# EAGLE design TeamB_PDS_Schematic_new (EAGLE 7.1.0)
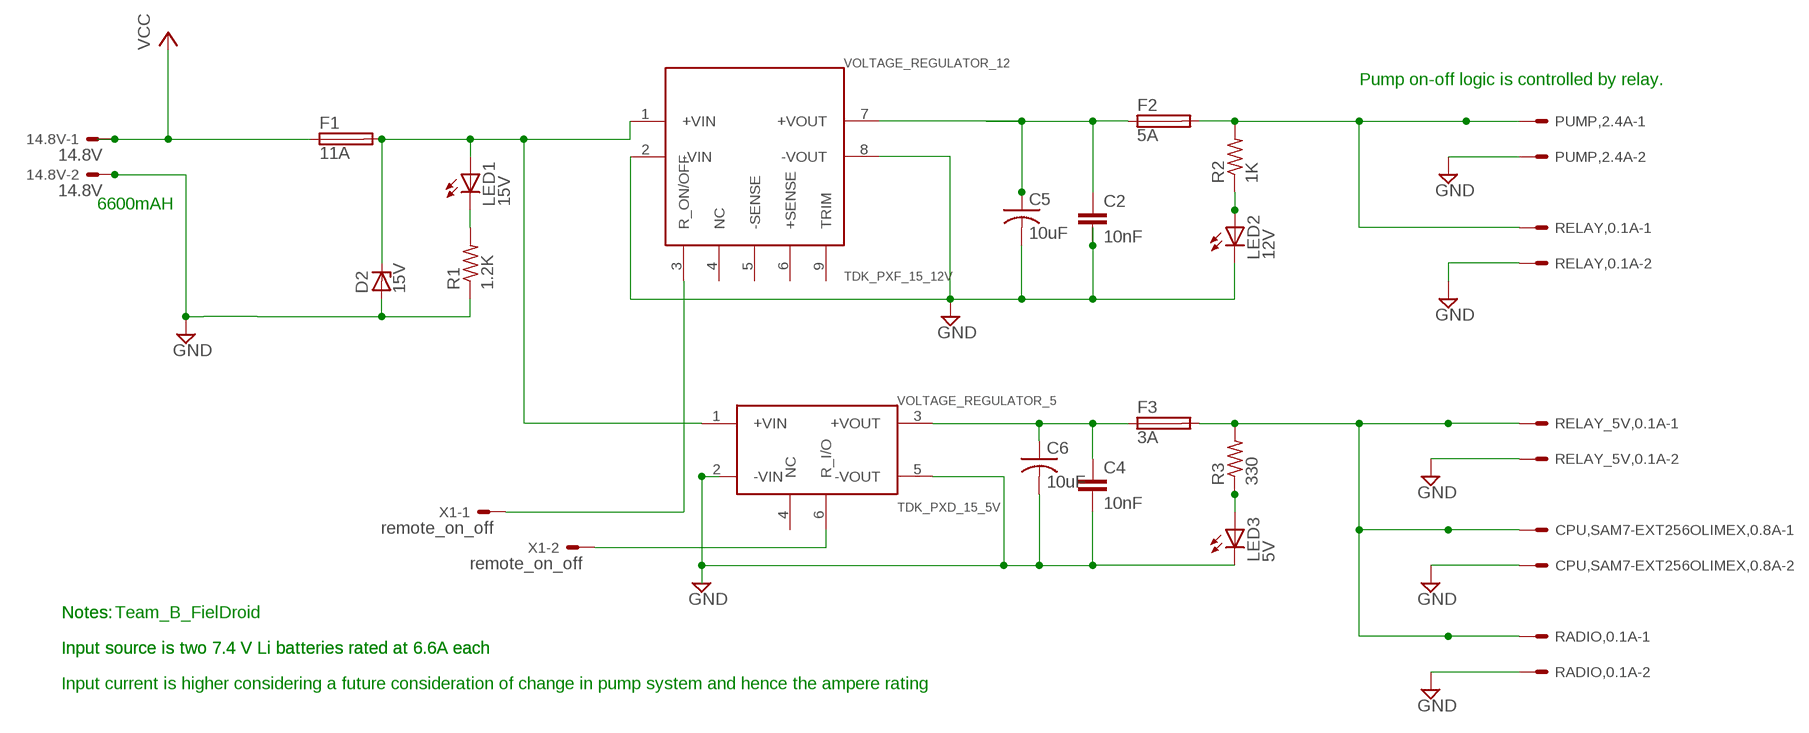
[diagram p0: schematic, sheet 1]

## Parts
14.8V  14.8V  5566-2  [5566-2]
C2  10nF  C2.5/4  [C2.5-4]
C4  10nF  C2.5/4  [C2.5-4]
C5  10uF  C-US050-045X075  [C050-045X075]
C6  10uF  C-US050-045X075  [C050-045X075]
CPU,SAM7-EXT256OLIMEX,0.8A  5566-2  [5566-2]
D2  15V  1N4728  [DO41Z10]
F1  11A  FUSEBLANK_5X20MM  [FUSE_HOLDER_5X20MM]
F2  5A  FUSEBLANK_5X20MM  [FUSE_HOLDER_5X20MM]
F3  3A  FUSEBLANK_5X20MM  [FUSE_HOLDER_5X20MM]
LED1  15V  LED5MM  [LED5MM]
LED2  12V  LED5MM  [LED5MM]
LED3  5V  LED5MM  [LED5MM]
PUMP,2.4A  5566-2  [5566-2]
R1  1.2K  R-US_0309/12  [0309/12]
R2  1K  R-US_0309/12  [0309/12]
R3  330  R-US_0309/12  [0309/12]
RADIO,0.1A  5566-2  [5566-2]
RELAY,0.1A  5566-2  [5566-2]
RELAY_5V,0.1A  5566-2  [5566-2]
VOLTAGE_REGULATOR_5  TDK_PXD_15_5V  [TDK-PXD_15-5V]
VOLTAGE_REGULATOR_12  TDK_PXF_15_12V  [TDK_PXF_15_12V]
X1  remote_on_off  5566-2  [5566-2]

## Nets
GND: 14.8V.2 C2.2 C4.2 C5.2 C6.2 CPU,SAM7-EXT256OLIMEX,0.8A.2 D2.A LED2.K(C) LED3.K(C) PUMP,2.4A.2 R1.1 RADIO,0.1A.2 RELAY,0.1A.2 RELAY_5V,0.1A.2 VOLTAGE_REGULATOR_5.2(-VIN) VOLTAGE_REGULATOR_5.5(-VOUT) VOLTAGE_REGULATOR_12.2(-VIN) VOLTAGE_REGULATOR_12.8(-VOUT)
N$1: LED1.K(C) R1.2
N$2: C4.1 C6.1 F3.1 VOLTAGE_REGULATOR_5.3(+VOUT)
N$3: D2.C F1.2 LED1.A VOLTAGE_REGULATOR_5.1(+VIN) VOLTAGE_REGULATOR_12.1(+VIN)
N$4: C2.1 C5.1 F2.1 VOLTAGE_REGULATOR_12.7(+VOUT)
N$5: LED2.A R2.1
N$6: VOLTAGE_REGULATOR_12.3(R_ON/OFF) X1.1
N$7: VOLTAGE_REGULATOR_5.6(R_I/O) X1.2
N$10: CPU,SAM7-EXT256OLIMEX,0.8A.1 F3.2 R3.2 RADIO,0.1A.1 RELAY_5V,0.1A.1
N$11: LED3.A R3.1
RELAY_12V,0.1A: F2.2 PUMP,2.4A.1 R2.2 RELAY,0.1A.1
VCC,14.8V,6.6A: 14.8V.1 F1.1 ; supply symbol labelled VCC
Unconnected: VOLTAGE_REGULATOR_5.4(NC) VOLTAGE_REGULATOR_12.4(NC) VOLTAGE_REGULATOR_12.5(-SENSE) VOLTAGE_REGULATOR_12.6(+SENSE) VOLTAGE_REGULATOR_12.9(TRIM)

## Notes on the sheet
- Pump on-off logic is controlled by relay.
- 6600mAH
- Notes: | Notes: | Team_B_FielDroid
- Input source is two 7.4 V Li batteries rated at 6.6A each | Input source is two 7.4 V Li batteries rated at 6.6A each
- Input current is higher considering a future consideration of change in pump system and hence the ampere rating

## Library data of the parts
14.8V CPU,SAM7-EXT256OLIMEX,0.8A PUMP,2.4A RADIO,0.1A RELAY,0.1A RELAY_5V,0.1A X1 = con-molex:5566-2: Mini FIT connector 2 pol Source: http://www.molex.com; OC_FARNELL: 1822072; OC_NEWARK: unknown
C2 C4 = capacitor-wima:C: CAPACITOR naming: grid - package width
C5 C6 = rcl:C-US: CAPACITOR, American symbol
D2 = diode:1N4728: Z DIODE 3.3 V, 1W, 5 percent
F1-F3 = fuse:FUSE: Fuse; OC_FARNELL: unknown; OC_NEWARK: unknown
LED1-LED3 = led:LED: LED OSRAM: - CHIPLED LG R971, LG N971, LY N971, LG Q971, LY Q971, LO R971, LY R971 LH N974, LH R974 LS Q976, LO Q976, LY Q976 LO Q996 - Hyper CHIPLED LW Q18S LB Q993, LB Q99A, LB R99A - SideLED LS A670, LO A670, LY A670, LG A670, LP A670 LB A673, LV A673, LT A673, LW A673 LH A674 LY A675 LS A676, LA A676, LO A676, LY A676, LW A676 LS A679, LY A679, LG A679 - Hyper Micro SIDELED® LS Y876, LA Y876, LO Y876, LY Y876 LT Y87S - SmartLED LW L88C, LW L88S LB L89C, LB L89S, LG L890 LS L89K, LO L89K, LY L89K LS L896, LA L896, LO L896, LY L896 - TOPLED LS T670, LO T670, LY T670, LG T670, LP T670 LSG T670, LSP T670, LSY T670, LOP T670, LYG T670 LG T671, LOG T671, LSG T671 LB T673, LV T673, LT T673, LW T673 LH T674 LS T676, LA T676, LO T676, LY T676, LB T676, LH T676, LSB T676, LW T676 LB T67C, LV T67C, LT T67C, LS T67K, LO T67K, LY T67K, LW E67C LS E67B, LA E67B, LO E67B, LY E67B, LB E67C, LV E67C, LT E67C LW T67C LS T679, LY T679, LG T679 LS T770, LO T770, LY T770, LG T770, LP T770 LB T773, LV T773, LT T773, LW T773 LH T774 LS E675, LA E675, LY E675, LS T675 LS T776, LA T776, LO T776, LY T776, LB T776 LHGB T686 LT T68C, LB T68C - Hyper Mini TOPLED® LB M676 - Mini TOPLED Santana® LG M470 LS M47K, LO M47K, LY M47K Source: http://www.osram.convergy.de LUXEON: - LUMILED® LXK2-PW12-R00, LXK2-PW12-S00, LXK2-PW14-U00, LXK2-PW14-V00 LXK2-PM12-R00, LXK2-PM12-S00, LXK2-PM14-U00 LXK2-PE12-Q00, LXK2-PE12-R00, LXK2-PE12-S00, LXK2-PE14-T00, LXK2-PE14-U00 LXK2-PB12-K00, LXK2-PB12-L00, LXK2-PB12-M00, LXK2-PB14-N00, LXK2-PB14-P00, LXK2-PB14-Q00 LXK2-PR12-L00, LXK2-PR12-M00, LXK2-PR14-Q00, LXK2-PR14-R00 LXK2-PD12-Q00, LXK2-PD12-R00, LXK2-PD12-S00 LXK2-PH12-R00, LXK2-PH12-S00 LXK2-PL12-P00, LXK2-PL12-Q00, LXK2-PL12-R00 Source: www.luxeon.com KINGBRIGHT: KA-3528ASYC Source: www.kingbright.com
R1-R3 = rcl:R-US_: RESISTOR, American symbol
VOLTAGE_REGULATOR_5 = TeamB_Task11:TDK_PXD_15_5V
VOLTAGE_REGULATOR_12 = TeamB_Task11:TDK_PXF_15_12V

## Board
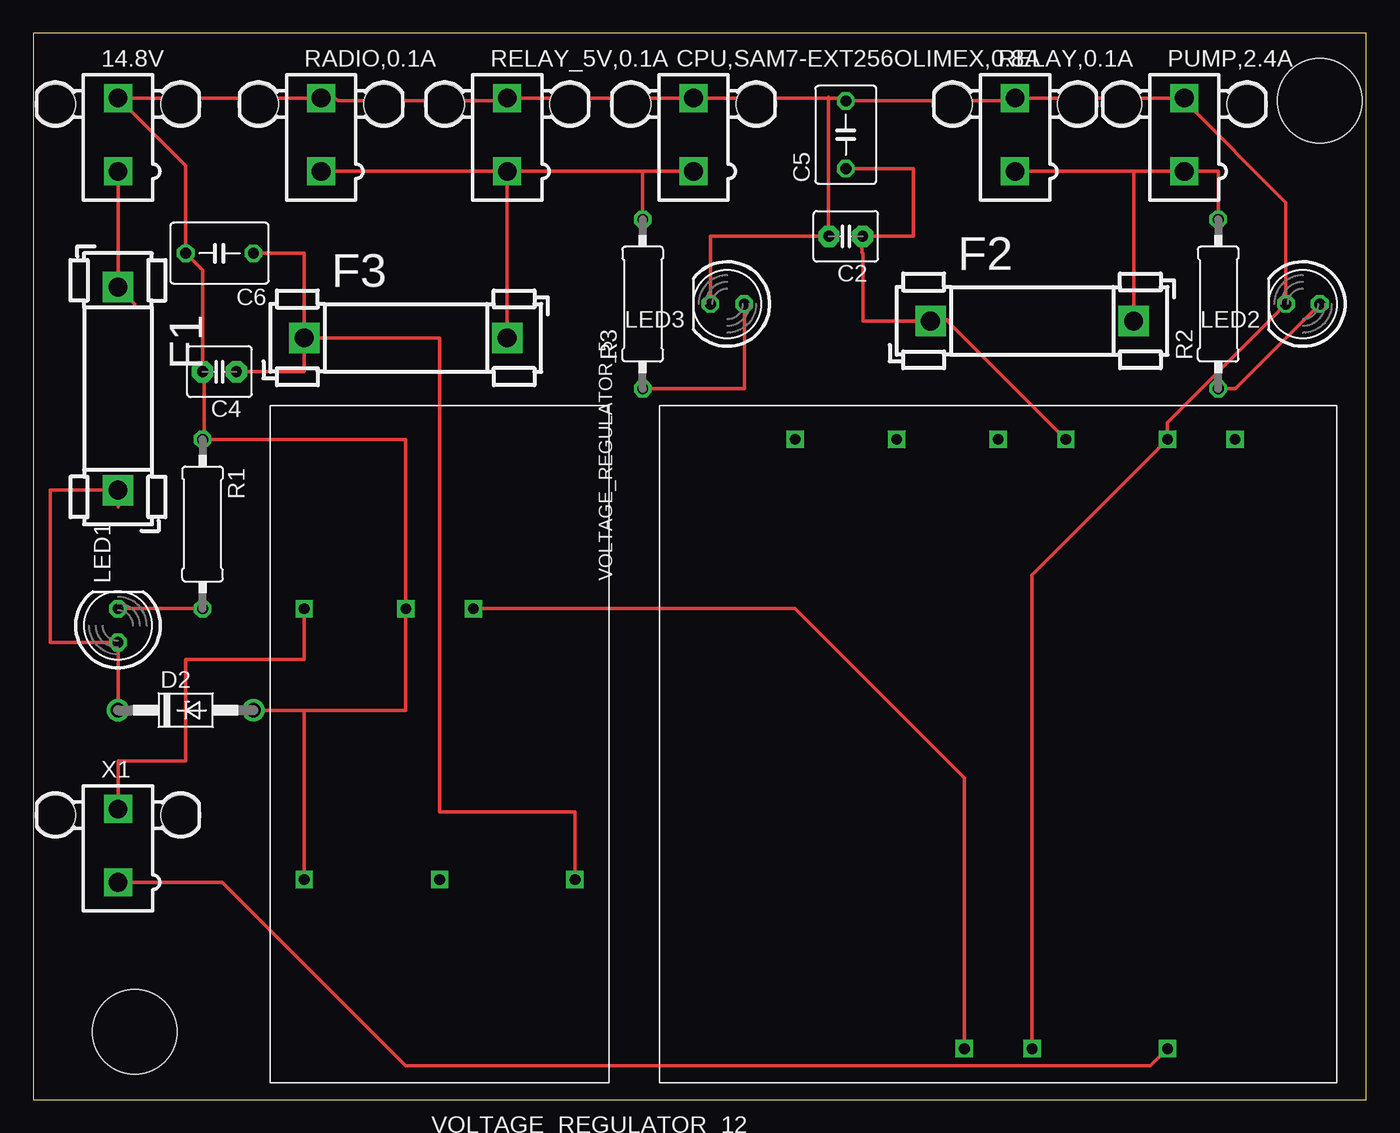
[diagram p1: board, top side]
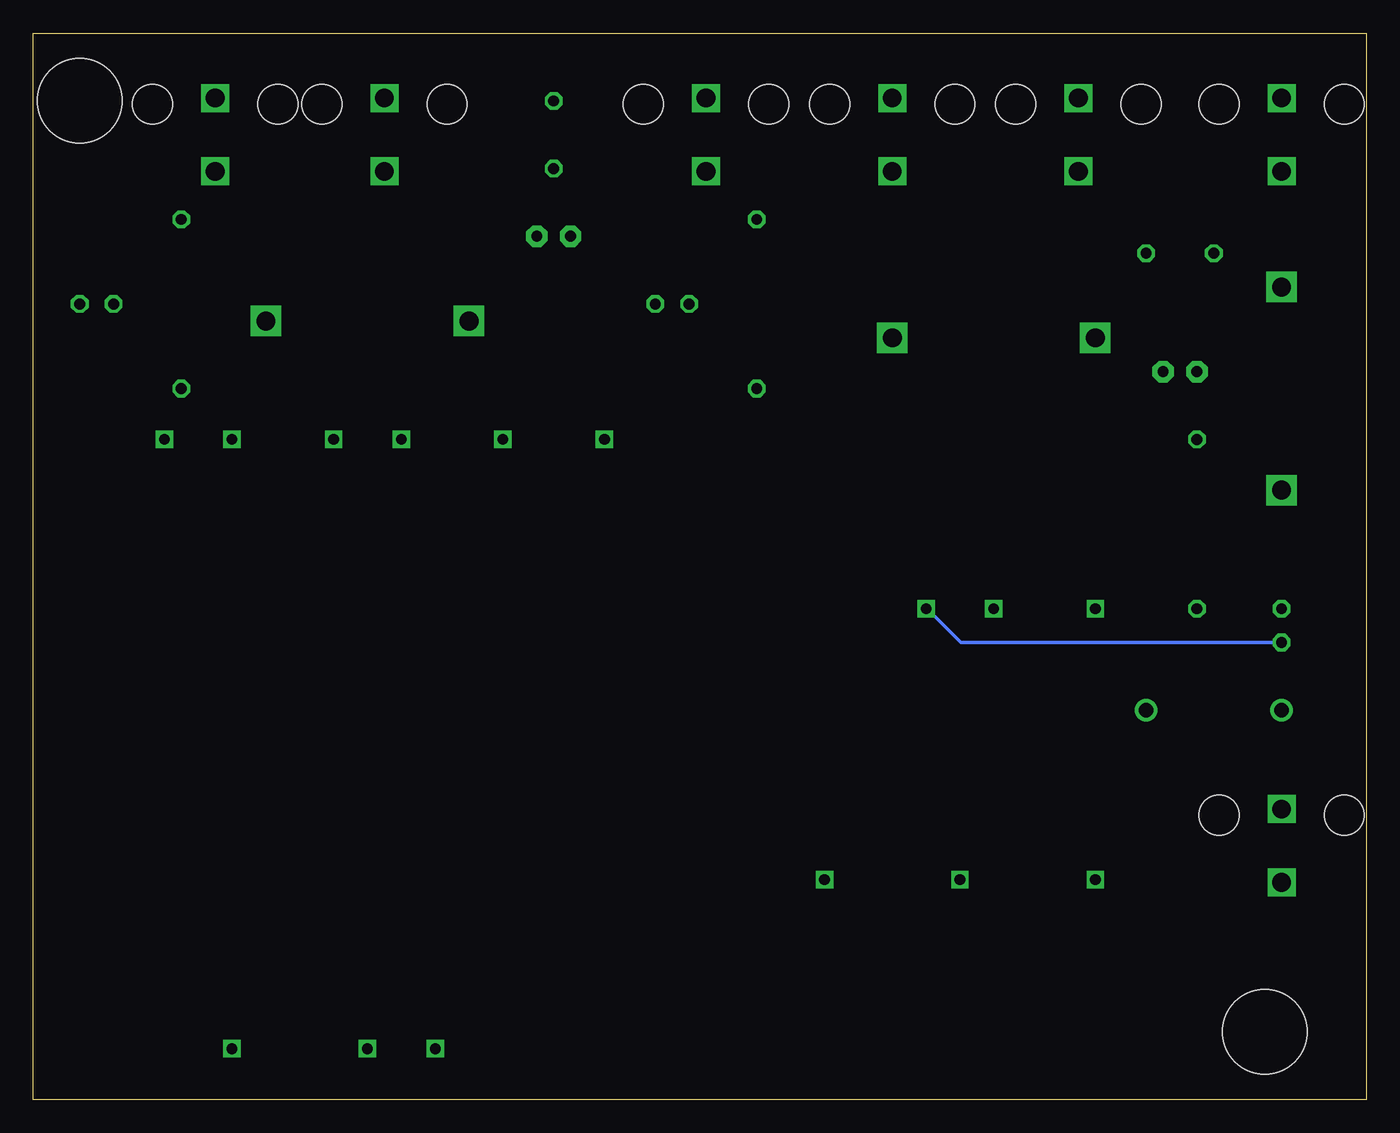
[diagram p2: board, bottom side, seen from below]

Size 100 x 80 mm. Coordinates in mm from the lower left corner, seen from the top.
Outline: 0,0 100,0 100,80 0,80 0,0
Copper layers (1*16): Top 0.035mm / dielectric 1.5mm / Bottom 0.035mm
Design rules "default": minimum track width 10mil, minimum drill 24mil, track to track 8mil, track to pad 8mil, pad to pad 8mil, via to via 8mil, smd to smd 8mil, copper to edge 40mil, drill to drill 8mil, minimum pad ring 10mil, minimum via ring 8mil, stop-mask expansion 4mil, vias tented up to drill 0mil, thermal gap 10mil
Holes 6.35 mm at 7.62,5.08 96.52,74.93

### Footprints (pad centres in the part's own frame; a part is rotated, then mirrored left to right if it is on the bottom)
5566-2 = drill 1.4 square: 1 0,-2.75; 2 0,2.75 | hole 3: 4.7,2.29; -4.7,2.29
C2.5-4 = drill 0.813 pad 1.6 octagon: 1 -1.27,0; 2 1.27,0
C050-045X075 = drill 0.813 octagon: 1 -2.54,0; 2 2.54,0
DO41Z10 = drill 1.118: A 5.08,0; C -5.08,0
FUSE_HOLDER_5X20MM = drill 1.422 pad 2.286 square: 1 0,0; 2 15.24,0
LED5MM = drill 0.813 octagon: A -1.27,0; K 1.27,0
0309/12 = drill 0.813 octagon: 1 -6.35,0; 2 6.35,0
TDK-PXD_15-5V = drill 0.8 pad 1.27 square: 1 -10.16,2.54; 2 -10.16,-2.54; 3 10.16,10.16; 4 10.16,0; 5 10.16,-10.16; 6 -10.16,-10.16
TDK_PXF_15_12V = drill 0.8 pad 1.27 square: 1 2.54,-2.54; 2 -2.54,-2.54; 3 -12.7,-2.54; 4 15.24,-48.26; 5 7.62,-48.26; 6 0,-48.26; 7 -5.08,-48.26; 8 -12.7,-48.26; 9 -17.78,-48.26

### Placement (x,y rotation side)
14.8V  6.35,72.39 0 top
C2  60.96,64.77 180 top
C4  13.97,54.61 180 top
C5  60.96,72.39 90 top
C6  13.97,63.5 180 top
CPU,SAM7-EXT256OLIMEX,0.8A  49.53,72.39 0 top
D2  11.43,29.21 0 top
F1  6.35,60.96 270 top
F2  67.31,58.42 0 top
F3  20.32,57.15 0 top
LED1  6.35,35.56 90 top
LED2  95.25,59.69 180 top
LED3  52.07,59.69 180 top
PUMP,2.4A  86.36,72.39 0 top
R1  12.7,43.18 270 top
R2  88.9,59.69 90 top
R3  45.72,59.69 90 top
RADIO,0.1A  21.59,72.39 0 top
RELAY,0.1A  73.66,72.39 0 top
RELAY_5V,0.1A  35.56,72.39 0 top
VOLTAGE_REGULATOR_5  30.48,26.67 270 top
VOLTAGE_REGULATOR_12  72.39,1.27 180 top
X1  6.35,19.05 0 top

### Tracks (layer width: path | path; a pad name or v marks a point on that pad's centre or on a via)
GND
  Top 0.254: VOLTAGE_REGULATOR_12.2 74.93,39.37 VOLTAGE_REGULATOR_12.8 85.09,50.8 LED2.K 93.98,67.31 86.36,74.93 86.15,74.93 PUMP,2.4A.2 RELAY,0.1A.2 73.45,74.93 C5.2 60.75,75.14 59.66,75.14 | RADIO,0.1A.2 14.8V.2 11.43,70.06 C6.2 12.7,62.23 C4.2 12.8,54.41 12.8,49.61 R1.1 27.94,49.53 VOLTAGE_REGULATOR_5.2 27.94,29.21 D2.A 20.32,29.21 VOLTAGE_REGULATOR_5.5 | RADIO,0.1A.2 21.72,75.14 | 21.72,75.14 22.65,75.14 22.86,74.93 35.35,74.93 RELAY_5V,0.1A.2 CPU,SAM7-EXT256OLIMEX,0.8A.2 59.66,75.14 | LED3.K 50.8,64.77 C2.2 59.66,64.92 59.66,75.14 | RADIO,0.1A.2 21.72,75.21 21.72,75.14 | 59.66,75.21 59.66,75.14
N$1
  Top 0.254: LED1.K R1.2
N$2
  Top 0.254: C6.1 20.32,63.5 F3.1 | C4.1 20.32,54.61 F3.1 | F3.1 30.48,57.15 30.48,21.59 40.64,21.59 VOLTAGE_REGULATOR_5.3
N$3
  Top 0.254: VOLTAGE_REGULATOR_12.1 69.85,24.13 57.15,36.83 VOLTAGE_REGULATOR_5.1 | D2.C LED1.A 1.27,34.29 1.27,45.72 F1.2 6.35,44.45
  Bottom 0.254: LED1.A 30.4,34.29 32.92,36.8 VOLTAGE_REGULATOR_5.1
N$4
  Top 0.254: VOLTAGE_REGULATOR_12.7 68.58,58.42 68.58,58.52 67.44,58.52 F2.1 62.23,58.42 62.23,63.5 62.18,63.55 62.18,64.69 C2.1 66.04,64.77 66.04,69.85 C5.1
N$5
  Top 0.254: R2.1 90.17,53.34 LED2.A
N$6
  Top 0.254: X1.1 14.18,16.3 27.94,2.54 83.82,2.54 VOLTAGE_REGULATOR_12.3
N$7
  Top 0.254: X1.2 6.35,25.4 11.43,25.4 11.43,33.02 20.32,33.02 VOLTAGE_REGULATOR_5.6
N$10
  Top 0.254: 35.66,57.15 F3.2 RELAY_5V,0.1A.1 | RADIO,0.1A.1 RELAY_5V,0.1A.1 | CPU,SAM7-EXT256OLIMEX,0.8A.1 45.72,69.64 | 45.72,69.64 R3.2 | RELAY_5V,0.1A.1 45.72,69.64
N$11
  Top 0.254: R3.1 53.34,53.34 LED3.A
RELAY_12V,0.1A
  Top 0.254: RELAY,0.1A.1 82.55,69.64 | 82.55,69.64 PUMP,2.4A.1 88.9,69.64 R2.2 | F2.2 82.55,69.64
VCC,14.8V,6.6A
  Top 0.254: 14.8V.1 F1.1 7.62,59.69